# Altium schematic sheet Power_Management_System.SchDoc: Power Management System (part 3 of 3)
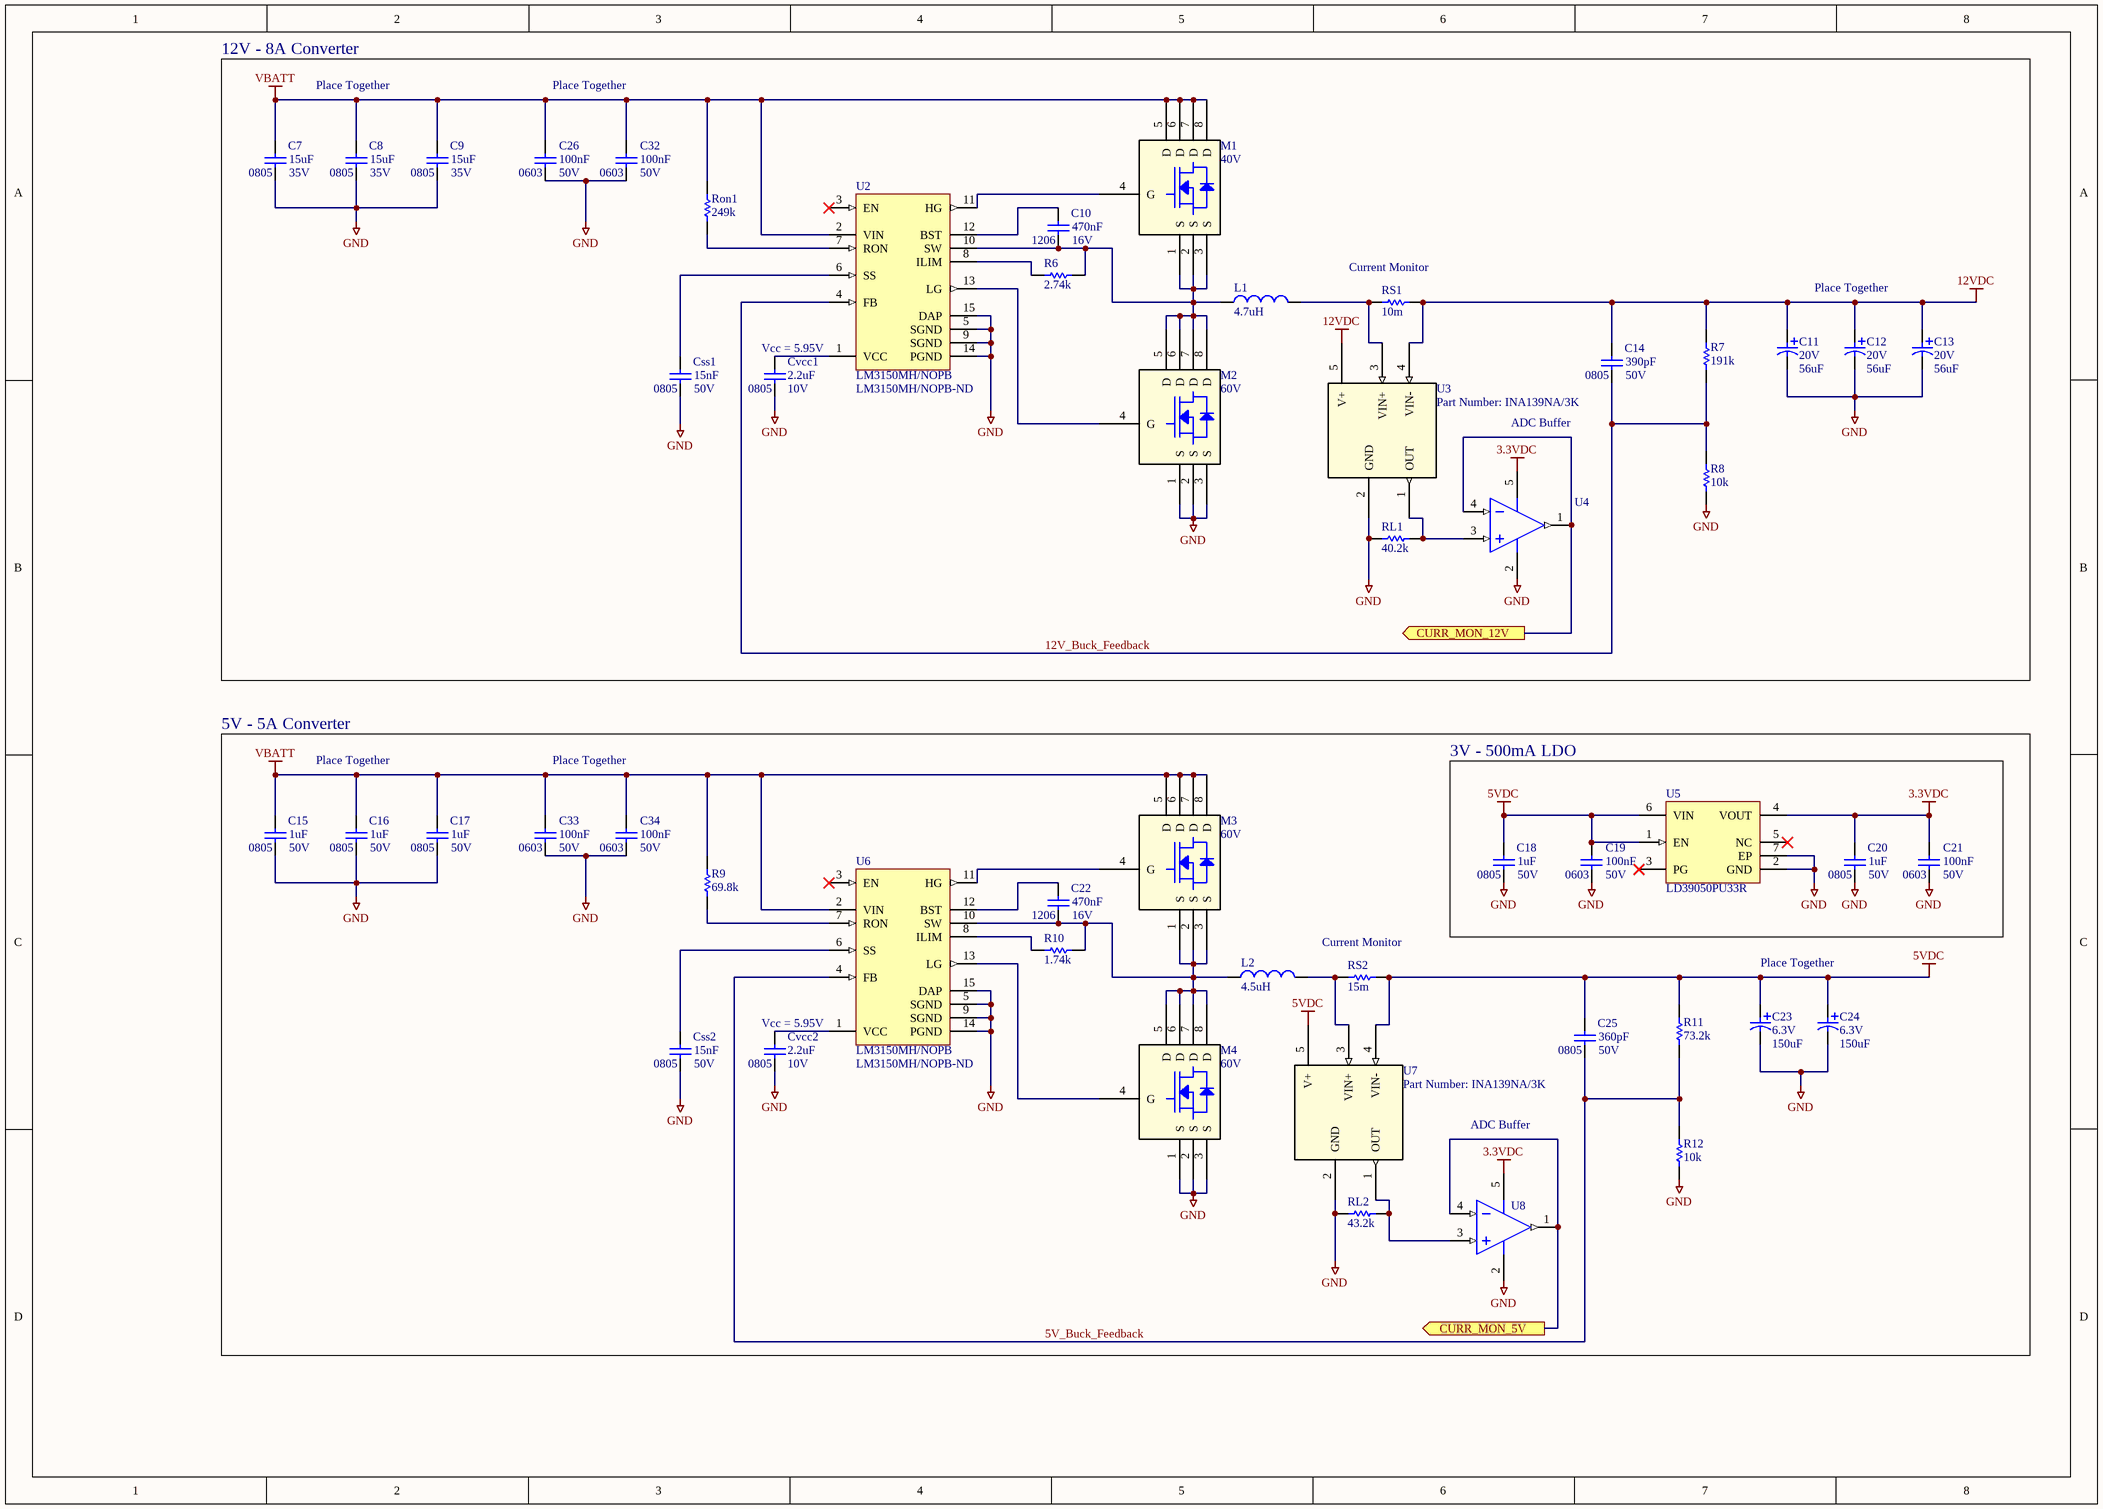
[diagram p2: Power_Management_System.SchDoc]

## Library data of the parts (continued)
U2 U6 = LM3150MH/NOPB: LM3150 - DC DC Cntrlr Single-OUT Step Down 6V to 42V Input 14-Pin HTSSOP EP Tube; Manufacturer: TI National Semiconductor; Number of Outputs: 1; Output Current: 12A; Output Voltage: 600mV; Max Frequency: 1MHz; Duty Cycle: 95%; Quiescent Current: 3.5mA; Supplier 1: Digi-Key; Manufacturer Part Number: LM3150MH/NOPB; Stock 1: 2498; Pricing 1: 1 = 3.78000, 10 = 3.39400, 94 = 3.20851, 188 = 2.78069, 564 = 2.36716, 1034 = 1.99640, 2538 = 1.89658, 5076 = 1.82528 (USD); RoHS: Yes; Mount: Surface Mount; Case/Package: HTSSOP EP; Number of Pins: 14; Contact Plating: Tin; Min Operating Temperature: -40°C; Max Operating Temperature: 125°C; Packaging: Rail/Tube; Features: UVLO; Max Input Voltage: 42V; Min Input Voltage: 6V; Switching Frequency: 1MHz; Min Supply Voltage: 6V; Max Supply Voltage: 42V; Min Output Voltage: 600mV; Length: 5mm; Height: 0.9mm; Width: 4.4mm; Radiation Hardening: No; REACH SVHC: No SVHC; Lead Free: Lead Free; ComponentLink1URL: https://datasheet.ciiva.com/15113/getdatasheetpartid-147301-15113226.pdf?src-supplier=Verical; ComponentLink1Description: https://datasheet.ciiva.com/15113/getdatasheetpartid-147301-15113226.pdf?src-supplier=Verical
U3 U7 = INA139NA/3K: No Description Available; Manufacturer: Texas Instruments; Built_By: EMA_UL_Team; Min Supply Voltage: 2.7V; Max Supply Voltage: 40V; Number of Channels: 1; Common Mode Rejection Ratio: 100dB; Nominal Supply Current: 125uA; Input Offset Voltage (Vos): 1mV; Input Bias Current: 10uA; Accuracy: 0.5%; Bandwidth: 440kHz; Manufacturer_Part_Number: INA139NA/3K; Vendor: Texas Instruments; Copyright: Copyright (C) 2018 Accelerated Designs. All rights reserved; RefDes: RefDes; Type: DEV; Value: Value; Supplier 1: Digi-Key; Manufacturer Part Number: INA139NA/3K; Stock 1: 23950; Pricing 1: 1 = 1.74000, 10 = 1.56100, 100 = 1.25490, 500 = 1.03104, 1000 = 0.85428 (USD); RoHS: Yes; Mount: Surface Mount; Case/Package: SOT-23; Number of Pins: 5; Weight: 0.000617oz; Min Operating Temperature: -40°C; Max Operating Temperature: 125°C; Packaging: Tape and Reel; Package Quantity: 3000; Number of Elements: 1; Radiation Hardening: No; Lead Free: Lead Free; ComponentLink1URL: https://datasheet.ciiva.com/15128/getdatasheetpartid-248784-15128606.pdf?src-supplier=Verical; ComponentLink1Description: https://datasheet.ciiva.com/15128/getdatasheetpartid-248784-15128606.pdf?src-supplier=Verical; ComponentLink2URL: https://datasheet.ciiva.com/26875/ina139na-3k-26875768.pdf?src-supplier=IIIC; ComponentLink2Description: https://datasheet.ciiva.com/26875/ina139na-3k-26875768.pdf?src-supplier=IIIC; ComponentLink3URL: https://datasheet.ciiva.com/2976/ina169-2976115.pdf?src-supplier=Avnet; ComponentLink3Description: https://datasheet.ciiva.com/2976/ina169-2976115.pdf?src-supplier=Avnet; ComponentLink4URL: https://datasheet.ciiva.com/1939/ina139-1939992.pdf?src-supplier=Digi-Key; ComponentLink4Description: https://datasheet.ciiva.com/1939/ina139-1939992.pdf?src-supplier=Digi-Key; ComponentLink5URL: https://datasheet.ciiva.com/1939/ina139-1939993.pdf?src-supplier=Digi-Key; ComponentLink5Description: https://datasheet.ciiva.com/1939/ina139-1939993.pdf?src-supplier=Digi-Key; ComponentLink6URL: https://datasheet.ciiva.com/1939/ina139-1939994.pdf?src-supplier=Digi-Key; ComponentLink6Description: https://datasheet.ciiva.com/1939/ina139-1939994.pdf?src-supplier=Digi-Key; Supplier Part Number 1: 296-26061-1-ND
U4 U8 = CMP-0272-00929-3: Single-Supply, Rail-to-Rail Operational Amplifier MicroAmplifier(TM) Series, 2.7 to 5.5 V, -40 to 85 degC, 5-pin SOT23 (DBV5), Green (RoHS & no Sb/Br); Manufacturer: Texas Instruments; Vio (25C)(Max)(mV): 0.5; CMRR(Min)(dB): 80; IIB(Max)(pA): 10; Number of Channels: 1; Total Supply Voltage(Min)(+5V is 5, +/-5V is 10): 2.7; Iq per channel(Max)(mA): 0.95; Slew Rate(Typ)(V/us): 6; Offset Drift(Typ)(uV/C): 2.5; Total Supply Voltage(Max)(+5V is 5, +/-5V is 10): 5.5; Sub Family: Low Input Bias Current Amp (<=10pA), Low Offset Voltage Amplifier (<=500uV), Low Supply Voltage Amplifier (<=2.7V), Precision Amplifier; Vn at 1kHz(Typ)(nV/rtHz): 25; PackageVersion: 4073253-4/K, 03/2006; PackageDescription: 5-Pin Plastic Small Outline, Body 1.6 x 2.9 mm, Pitch 0.95 mm; ComponentLink3URL: http://www.ti.com/litv/pdf/mpds018i; DatasheetVersion: SBOS073B; ComponentLink1Description: Manufacturer URL; ComponentLink1URL: http://www.ti.com/; Eco-Plan: Green (RoHS & no Sb/Br); Code_JEDEC: MO-178; ComponentLink3Description: Package Specification; ComponentLink2URL: http://www.ti.com/general/docs/lit/getliterature.tsp?genericPartNumber=OPA340&fileType=pdf; ComponentLink2Description: Datasheet; PackageReference: DBV0005A; PartNumber: OPA340NA/3K; Mounting Technology: Surface Mount
U5 = LD39050PU33R: 500 mA Low Quiescent Current Low Noise Voltage Regulator, 3.3V, 6-Pin VDFDPN, Tape and Reel CMP-0244-00288-; PackageReference: DFN6D; ComponentLink1Description: Manufacturer URL; ComponentLink1URL: http://www.st.com; PackageVersion: 2008; PackageDescription: 6-Pin Plastic, Dual LLP, 3 x 3 mm Body, 0.95 mm Pitch, Exposed Pad; ComponentLink2URL: http://www.st.com/internet/com/TECHNICAL_RESOURCES/TECHNICAL_LITERATURE/DATASHEET/CD00227527.pdf; DatasheetVersion: 1/03/2009; ComponentLink2Description: Datasheet